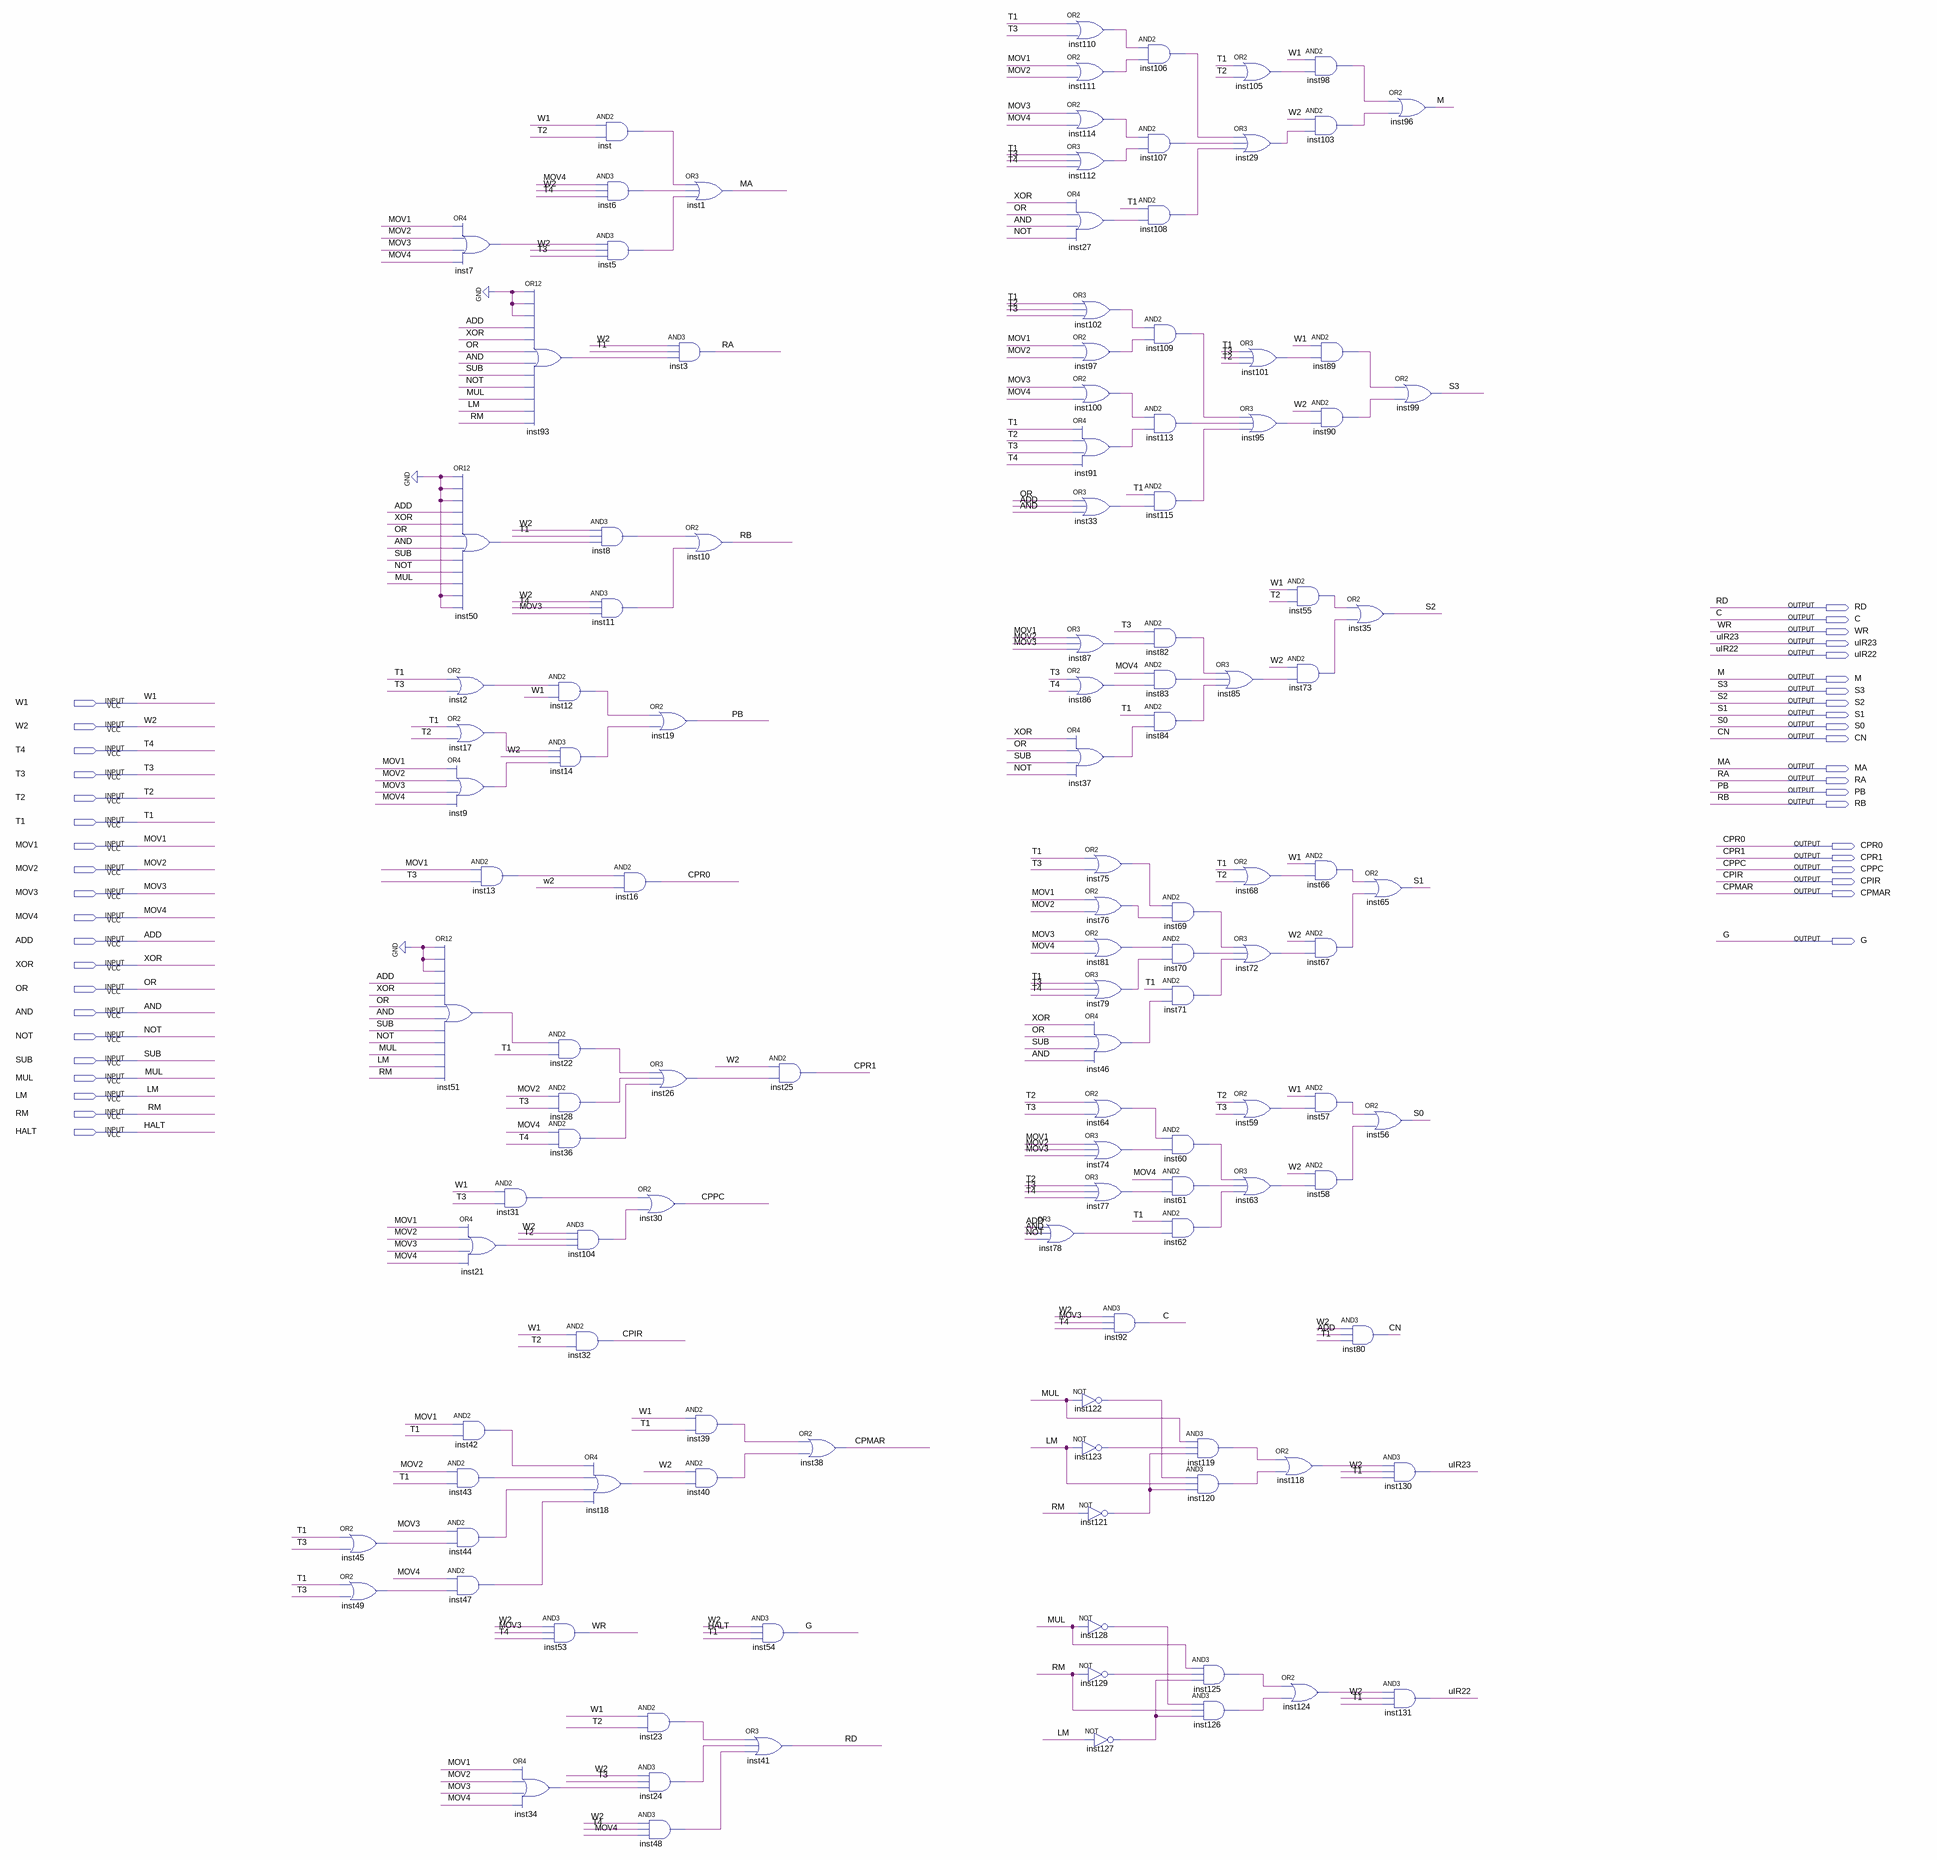
[diagram p0: schematic sheet]
// Quartus schematic Control.bdf as structural Verilog: 124 symbols, 41 pins
module Control (
  input  W1,
  input  W2,
  input  T4,
  input  T3,
  input  T2,
  input  T1,
  input  MOV1,
  input  MOV2,
  input  MOV3,
  input  MOV4,
  input  ADD,
  input  XOR,
  input  OR,
  input  AND,
  input  NOT,
  input  SUB,
  input  MUL,
  input  LM,
  input  RM,
  input  HALT,
  output RD,
  output C,
  output WR,
  output uIR23,
  output uIR22,
  output M,
  output S3,
  output S2,
  output S1,
  output S0,
  output CN,
  output MA,
  output RA,
  output PB,
  output RB,
  output CPR0,
  output CPR1,
  output CPPC,
  output CPIR,
  output CPMAR,
  output G
);

  wire inst2_out, inst5_out, inst6_out, inst7_out, inst8_out, inst9_out, inst11_out, inst12_out, inst13_out,
       inst14_out, inst17_out, inst18_out, inst21_out, inst22_out, inst23_out, inst24_out, inst26_out,
       inst27_out, inst28_out, inst29_out, inst31_out, inst33_out, inst34_out, inst36_out, inst37_out,
       inst39_out, inst40_out, inst42_out, inst43_out, inst44_out, inst45_out, inst46_out, inst47_out,
       inst48_out, inst49_out, inst50_out, inst51_out, inst55_out, inst57_out, inst58_out, inst59_out,
       inst60_out, inst61_out, inst62_out, inst63_out, inst64_out, inst66_out, inst67_out, inst68_out,
       inst69_out, inst70_out, inst71_out, inst72_out, inst73_out, inst74_out, inst75_out, inst76_out,
       inst77_out, inst78_out, inst79_out, inst81_out, inst82_out, inst83_out, inst84_out, inst85_out,
       inst86_out, inst87_out, inst89_out, inst90_out, inst91_out, inst93_out, inst95_out, inst97_out,
       inst98_out, inst100_out, inst101_out, inst102_out, inst103_out, inst104_out, inst105_out, inst106_out,
       inst107_out, inst108_out, inst109_out, inst110_out, inst111_out, inst112_out, inst113_out,
       inst114_out, inst115_out, inst118_out, inst119_out, inst120_out, inst121_out, inst122_out,
       inst123_out, inst124_out, inst125_out, inst126_out, inst127_out, inst128_out, inst129_out, inst_out;

  or inst45 (inst45_out, T1, T3);
  or inst49 (inst49_out, T1, T3);
  or inst7 (inst7_out, MOV1, MOV2, MOV3, MOV4);
  or inst50 (inst50_out, 1'b0, 1'b0, 1'b0, ADD, XOR, OR, AND, SUB, NOT, MUL, 1'b0, 1'b0);
  or inst2 (inst2_out, T1, T3);
  or inst17 (inst17_out, T1, T2);
  or inst9 (inst9_out, MOV1, MOV2, MOV3, MOV4);
  and inst13 (inst13_out, MOV1, T3);
  or inst51 (inst51_out, 1'b0, 1'b0, 1'b0, ADD, XOR, OR, AND, SUB, NOT, MUL, LM, RM);
  or inst21 (inst21_out, MOV1, MOV2, MOV3, MOV4);
  and inst42 (inst42_out, MOV1, T1);
  and inst43 (inst43_out, MOV2, T1);
  and inst44 (inst44_out, MOV3, inst45_out);
  and inst47 (inst47_out, MOV4, inst49_out);
  or inst93 (inst93_out, 1'b0, 1'b0, 1'b0, ADD, XOR, OR, AND, SUB, NOT, MUL, LM, RM);
  and inst31 (inst31_out, W1, T3);
  or inst34 (inst34_out, MOV1, MOV2, MOV3, MOV4);
  and inst12 (inst12_out, inst2_out, W1);
  and inst14 (inst14_out, inst17_out, W2, inst9_out);
  and inst22 (inst22_out, inst51_out, T1);
  and inst28 (inst28_out, MOV2, T3);
  and inst36 (inst36_out, MOV4, T4);
  and inst104 (inst104_out, W2, T2, inst21_out);
  and inst32 (CPIR, W1, T2);
  and inst53 (WR, W2, MOV3, T4);
  and inst (inst_out, W1, T2);
  and inst6 (inst6_out, MOV4, W2, T4);
  and inst5 (inst5_out, inst7_out, W2, T3);
  and inst8 (inst8_out, W2, T1, inst50_out);
  and inst11 (inst11_out, W2, T4, MOV3);
  and inst16 (CPR0, inst13_out, W2);
  or inst18 (inst18_out, inst42_out, inst43_out, inst44_out, inst47_out);
  and inst3 (RA, W2, T1, inst93_out);
  or inst19 (PB, inst12_out, inst14_out);
  or inst26 (inst26_out, inst22_out, inst28_out, inst36_out);
  or inst30 (CPPC, inst31_out, inst104_out);
  and inst23 (inst23_out, W1, T2);
  and inst24 (inst24_out, W2, T3, inst34_out);
  and inst48 (inst48_out, W2, T4, MOV4);
  or inst1 (MA, inst_out, inst6_out, inst5_out);
  or inst10 (RB, inst8_out, inst11_out);
  and inst39 (inst39_out, W1, T1);
  and inst40 (inst40_out, W2, inst18_out);
  and inst54 (G, W2, HALT, T1);
  or inst41 (RD, inst23_out, inst24_out, inst48_out);
  and inst25 (CPR1, W2, inst26_out);
  or inst38 (CPMAR, inst39_out, inst40_out);
  or inst78 (inst78_out, ADD, AND, NOT);
  or inst110 (inst110_out, T1, T3);
  or inst111 (inst111_out, MOV1, MOV2);
  or inst114 (inst114_out, MOV3, MOV4);
  or inst112 (inst112_out, T1, T3, T4);
  or inst27 (inst27_out, XOR, OR, AND, NOT);
  or inst102 (inst102_out, T1, T2, T3);
  or inst97 (inst97_out, MOV1, MOV2);
  or inst100 (inst100_out, MOV3, MOV4);
  or inst91 (inst91_out, T1, T2, T3, T4);
  or inst33 (inst33_out, OR, ADD, AND);
  or inst87 (inst87_out, MOV1, MOV2, MOV3);
  or inst86 (inst86_out, T3, T4);
  or inst37 (inst37_out, XOR, OR, SUB, NOT);
  or inst75 (inst75_out, T1, T3);
  or inst76 (inst76_out, MOV1, MOV2);
  or inst81 (inst81_out, MOV3, MOV4);
  or inst79 (inst79_out, T1, T3, T4);
  or inst46 (inst46_out, XOR, OR, SUB, AND);
  or inst64 (inst64_out, T2, T3);
  or inst74 (inst74_out, MOV1, MOV2, MOV3);
  or inst77 (inst77_out, T2, T3, T4);
  not inst122 (inst122_out, MUL);
  not inst123 (inst123_out, LM);
  not inst121 (inst121_out, RM);
  not inst128 (inst128_out, MUL);
  not inst129 (inst129_out, RM);
  not inst127 (inst127_out, LM);
  and inst106 (inst106_out, inst110_out, inst111_out);
  and inst107 (inst107_out, inst114_out, inst112_out);
  and inst108 (inst108_out, T1, inst27_out);
  and inst109 (inst109_out, inst102_out, inst97_out);
  and inst113 (inst113_out, inst100_out, inst91_out);
  and inst115 (inst115_out, T1, inst33_out);
  and inst82 (inst82_out, T3, inst87_out);
  and inst83 (inst83_out, MOV4, inst86_out);
  and inst84 (inst84_out, T1, inst37_out);
  and inst92 (C, W2, MOV3, T4);
  and inst69 (inst69_out, inst75_out, inst76_out);
  and inst70 (inst70_out, inst81_out, inst79_out);
  and inst71 (inst71_out, T1, inst46_out);
  and inst60 (inst60_out, inst64_out, inst74_out);
  and inst61 (inst61_out, MOV4, inst77_out);
  and inst62 (inst62_out, T1, inst78_out);
  and inst119 (inst119_out, MUL, inst123_out, inst121_out);
  and inst120 (inst120_out, inst122_out, LM, inst121_out);
  and inst125 (inst125_out, MUL, inst129_out, inst127_out);
  and inst126 (inst126_out, inst128_out, RM, inst127_out);
  or inst105 (inst105_out, T1, T2);
  or inst29 (inst29_out, inst106_out, inst107_out, inst108_out);
  or inst101 (inst101_out, T1, T3, T2);
  or inst95 (inst95_out, inst109_out, inst113_out, inst115_out);
  or inst85 (inst85_out, inst82_out, inst83_out, inst84_out);
  or inst68 (inst68_out, T1, T2);
  or inst72 (inst72_out, inst69_out, inst70_out, inst71_out);
  or inst59 (inst59_out, T2, T3);
  or inst63 (inst63_out, inst60_out, inst61_out, inst62_out);
  and inst55 (inst55_out, W1, T2);
  and inst73 (inst73_out, W2, inst85_out);
  or inst118 (inst118_out, inst119_out, inst120_out);
  or inst124 (inst124_out, inst125_out, inst126_out);
  and inst98 (inst98_out, W1, inst105_out);
  and inst103 (inst103_out, W2, inst29_out);
  and inst89 (inst89_out, W1, inst101_out);
  and inst90 (inst90_out, W2, inst95_out);
  and inst66 (inst66_out, W1, inst68_out);
  and inst67 (inst67_out, W2, inst72_out);
  and inst57 (inst57_out, W1, inst59_out);
  and inst58 (inst58_out, W2, inst63_out);
  or inst35 (S2, inst55_out, inst73_out);
  or inst65 (S1, inst66_out, inst67_out);
  or inst56 (S0, inst57_out, inst58_out);
  and inst80 (CN, W2, ADD, T1);
  and inst130 (uIR23, inst118_out, W2, T1);
  and inst131 (uIR22, inst124_out, W2, T1);
  or inst96 (M, inst98_out, inst103_out);
  or inst99 (S3, inst89_out, inst90_out);
endmodule
